# EAGLE schematic stm v0.7 (EAGLE 9.5.1)
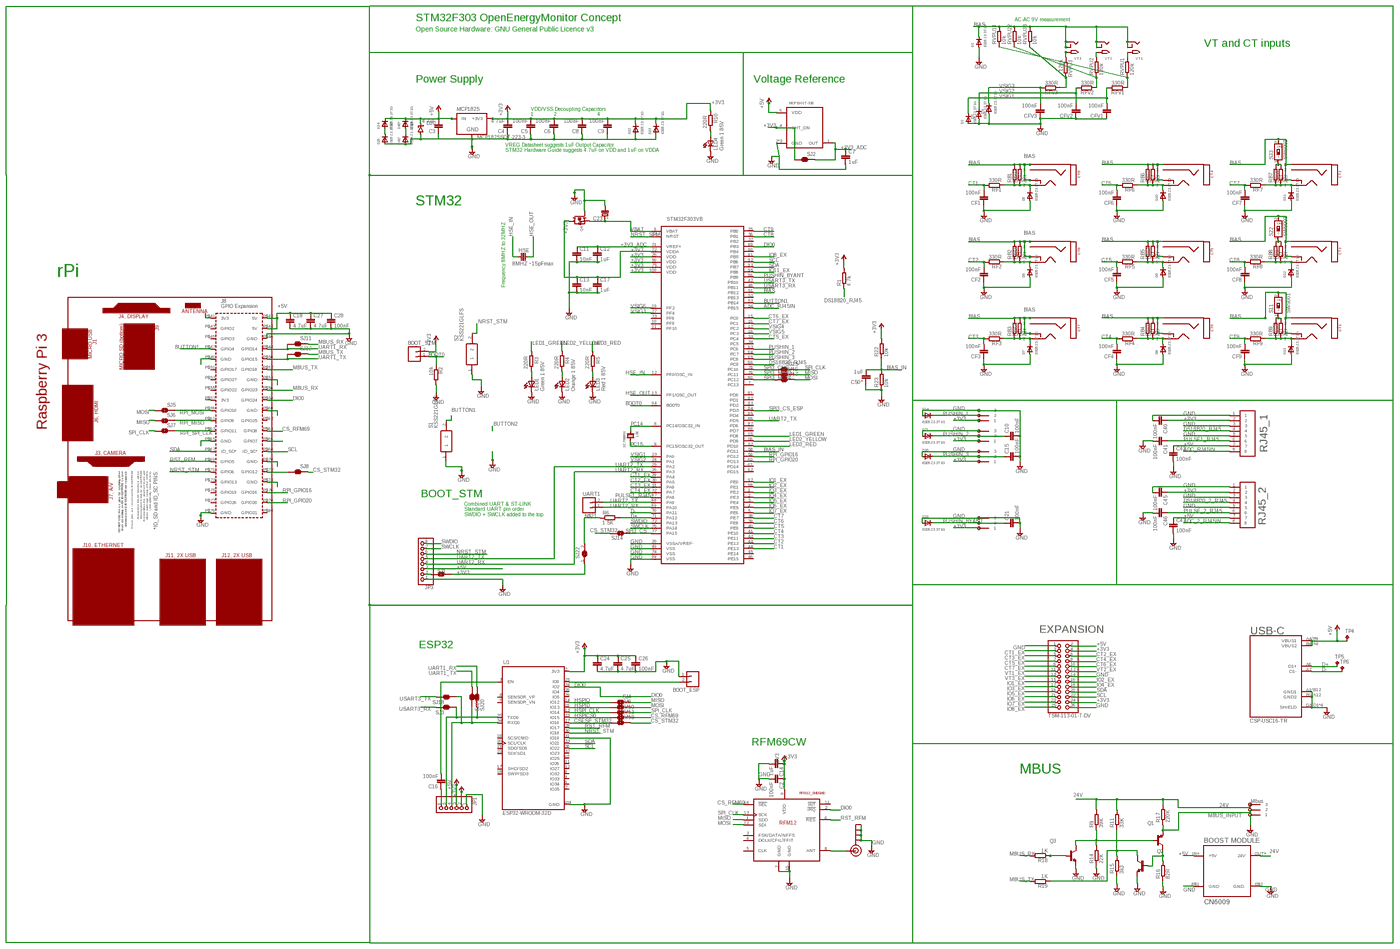
[diagram p0: schematic, sheet 1, overview]
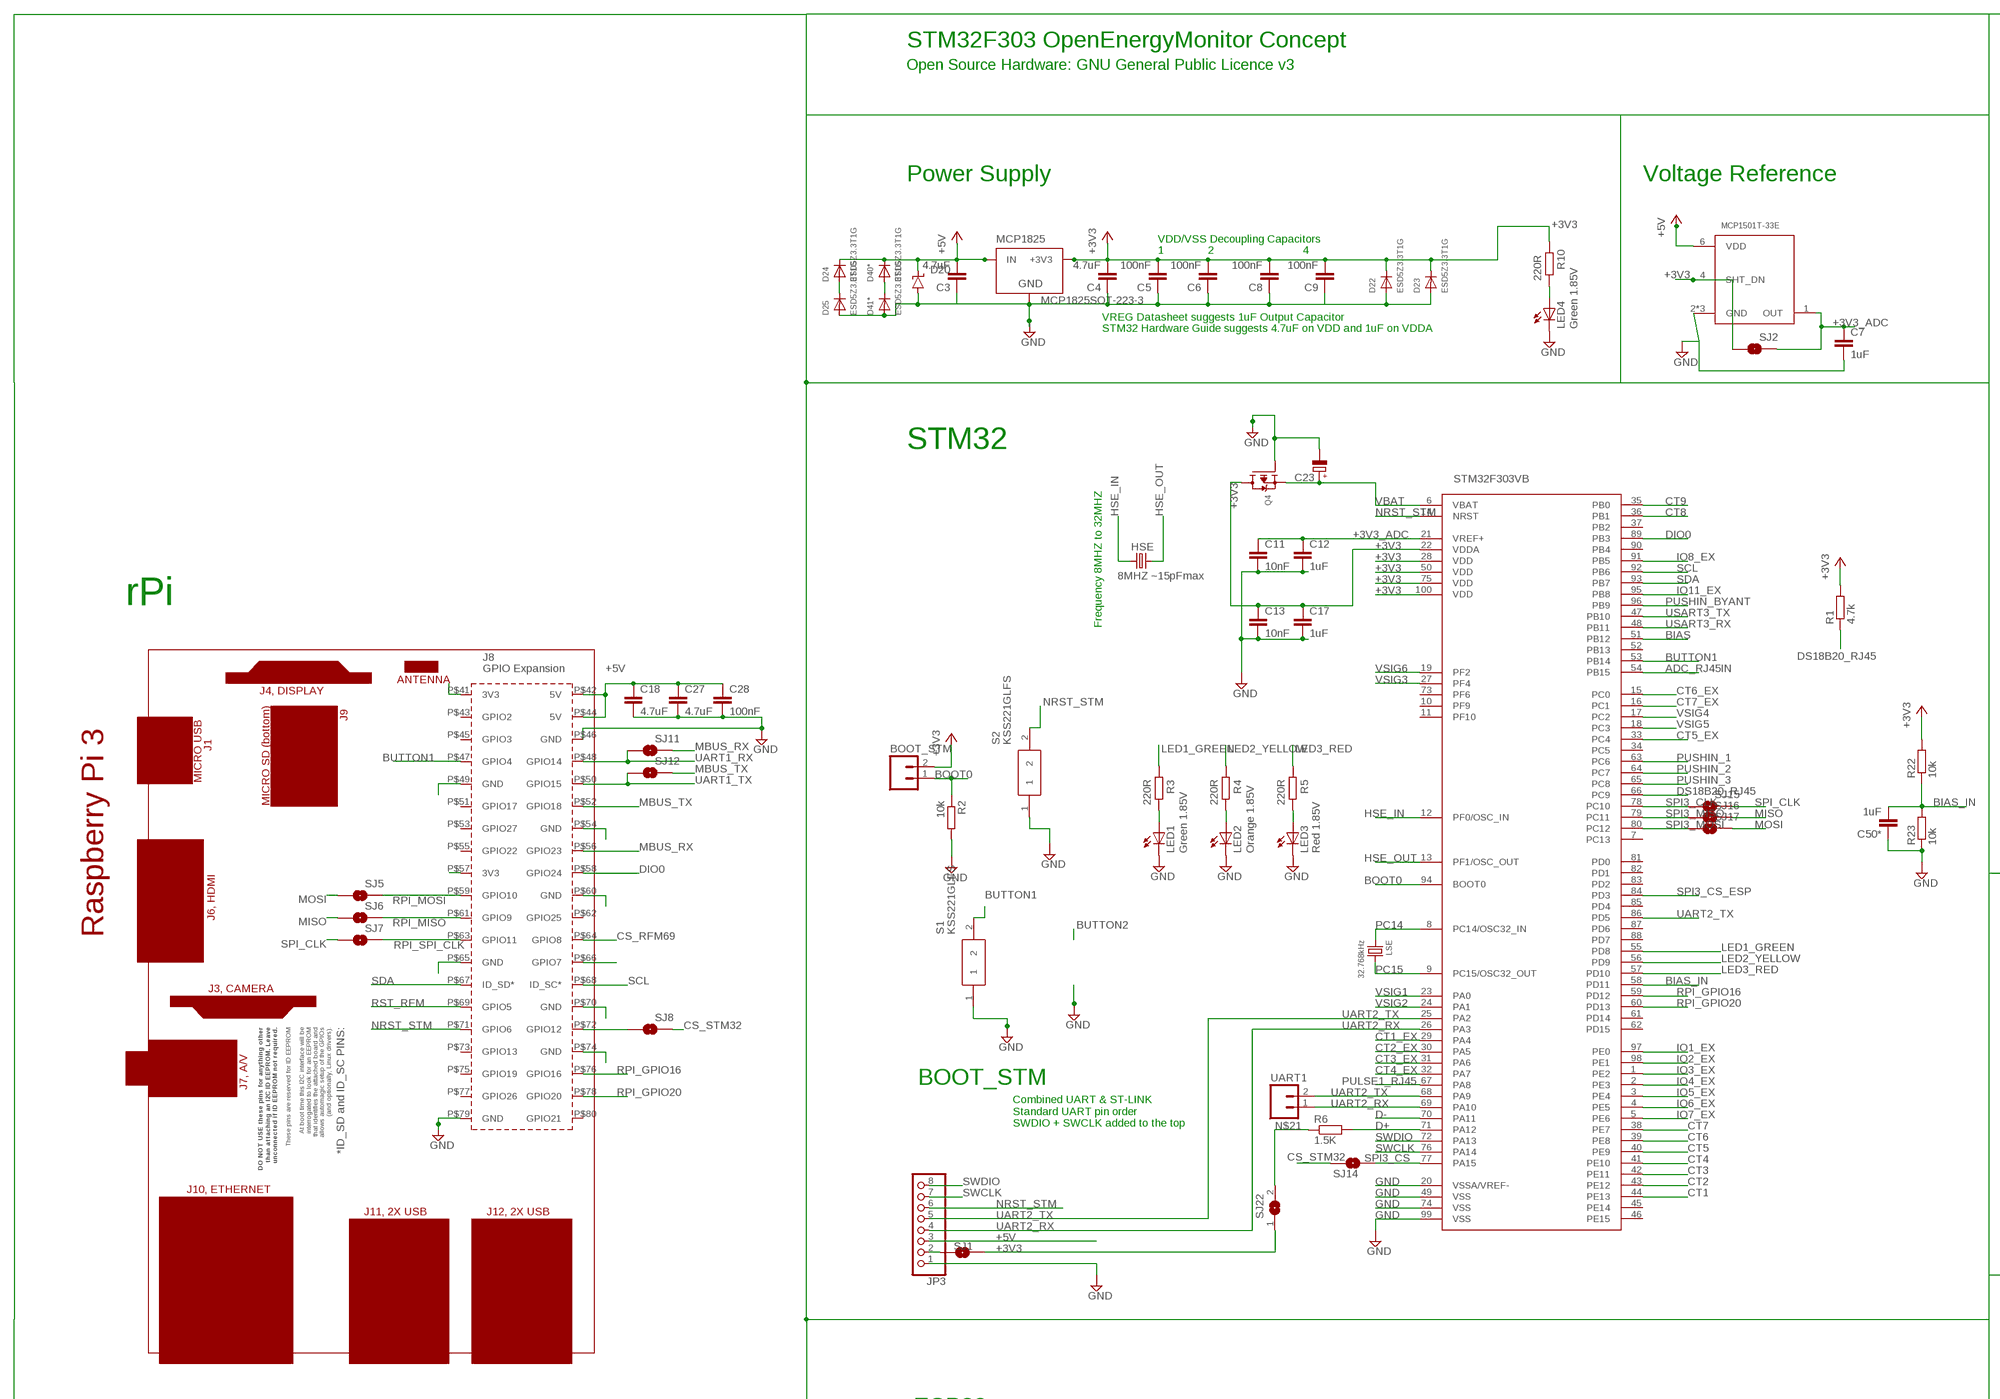
[diagram p1: schematic, sheet 1, part 1 of 4]
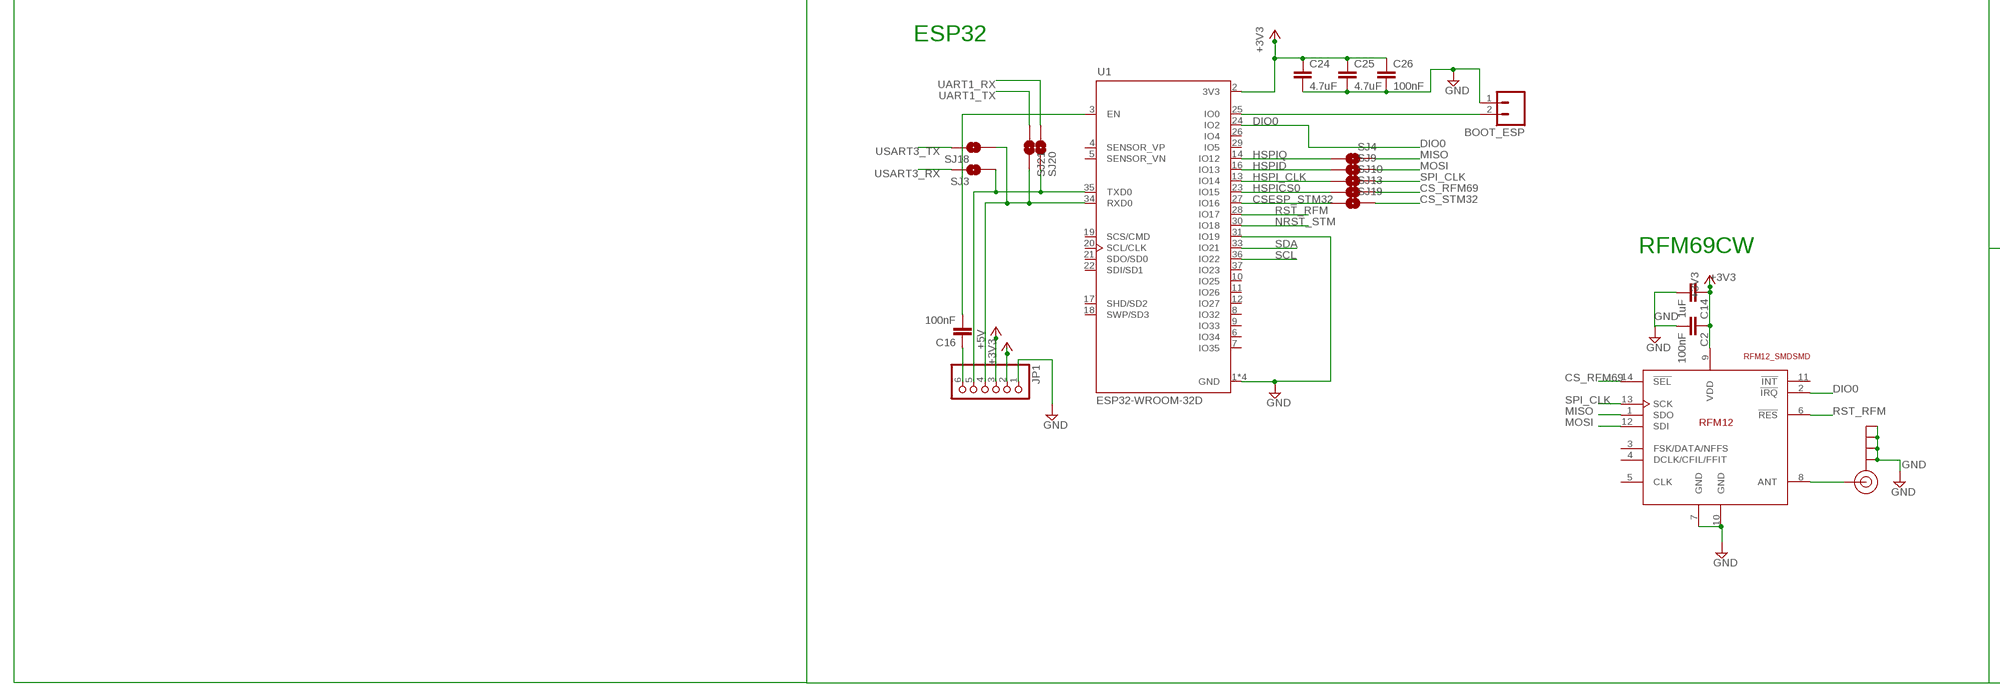
[diagram p2: schematic, sheet 1, part 2 of 4]
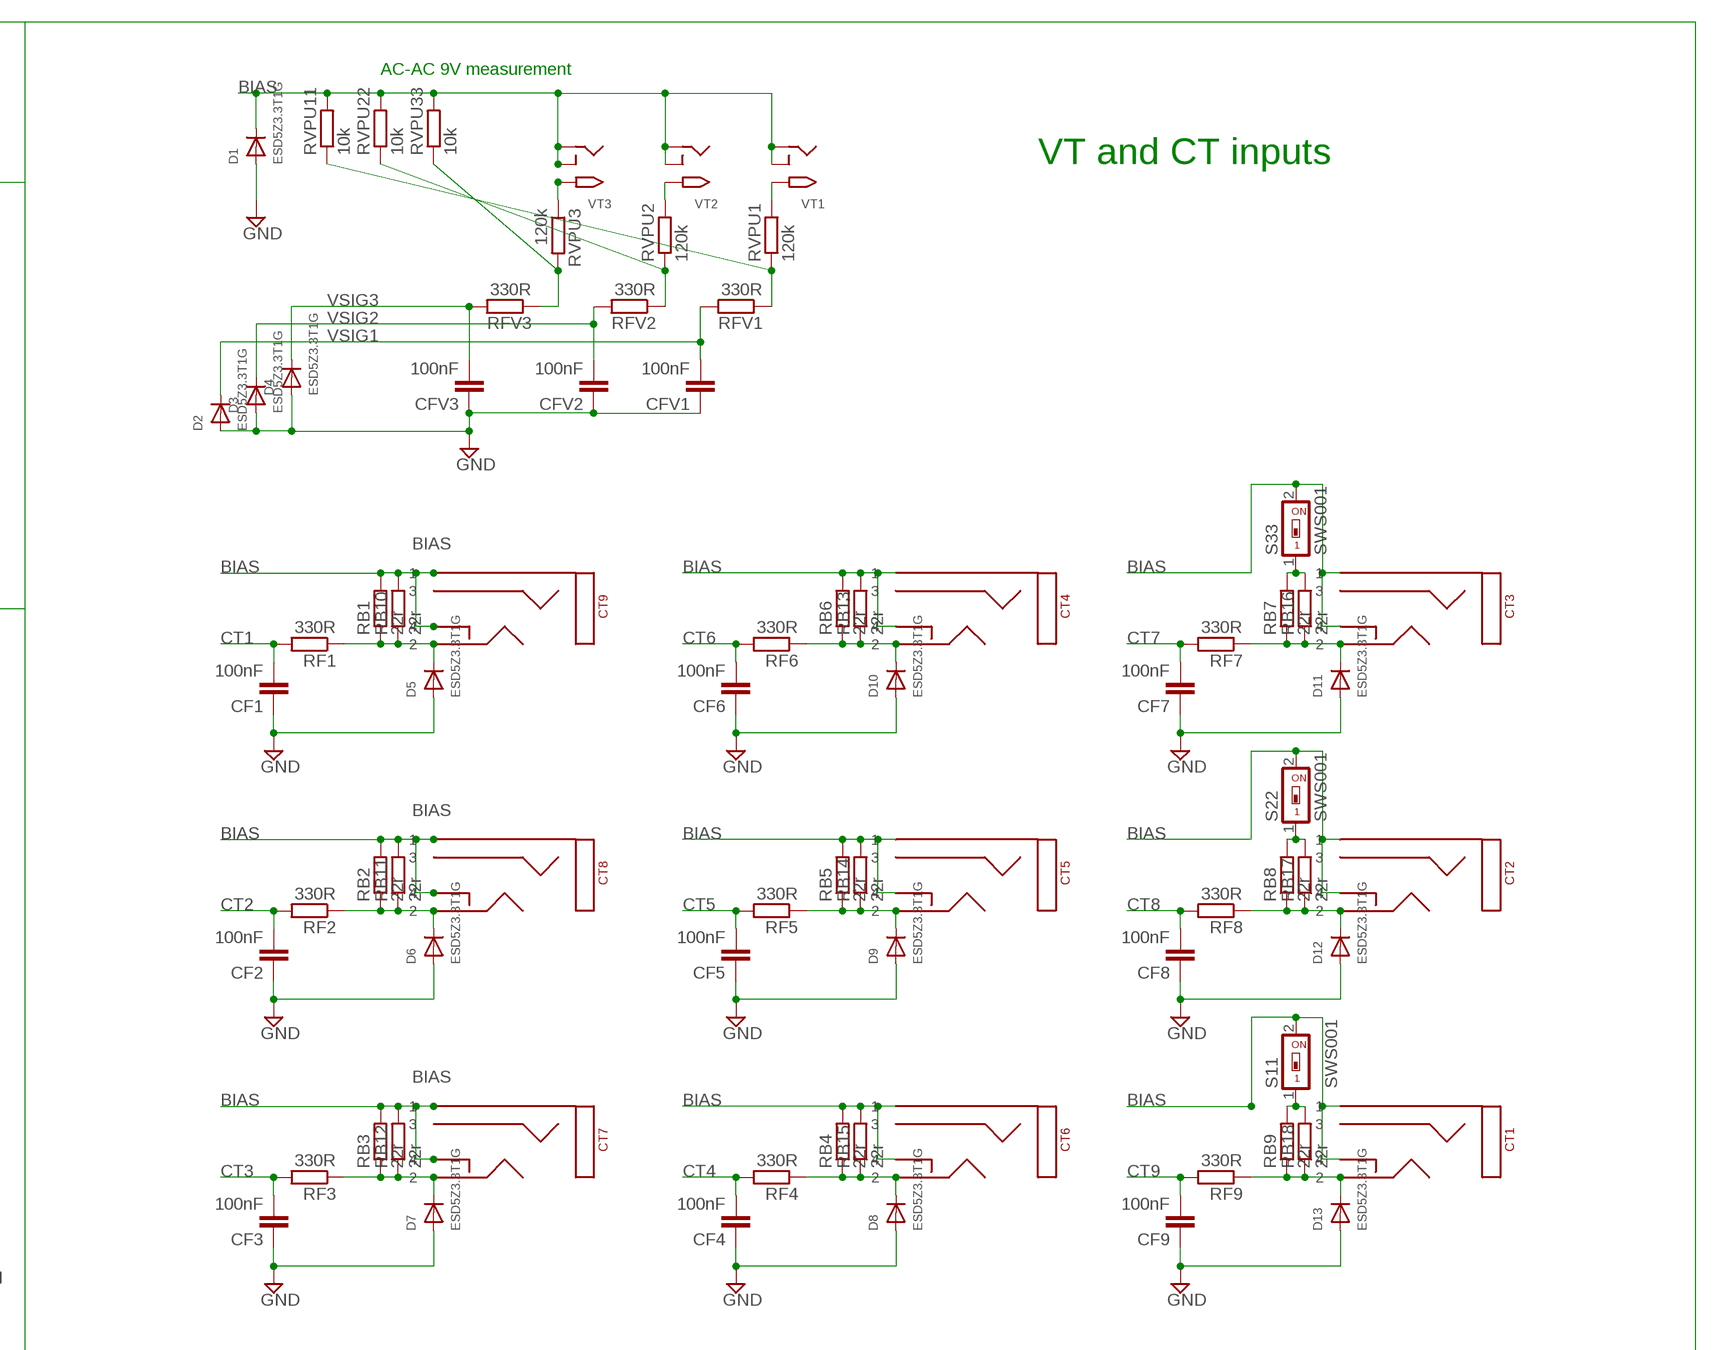
[diagram p3: schematic, sheet 1, part 3 of 4]
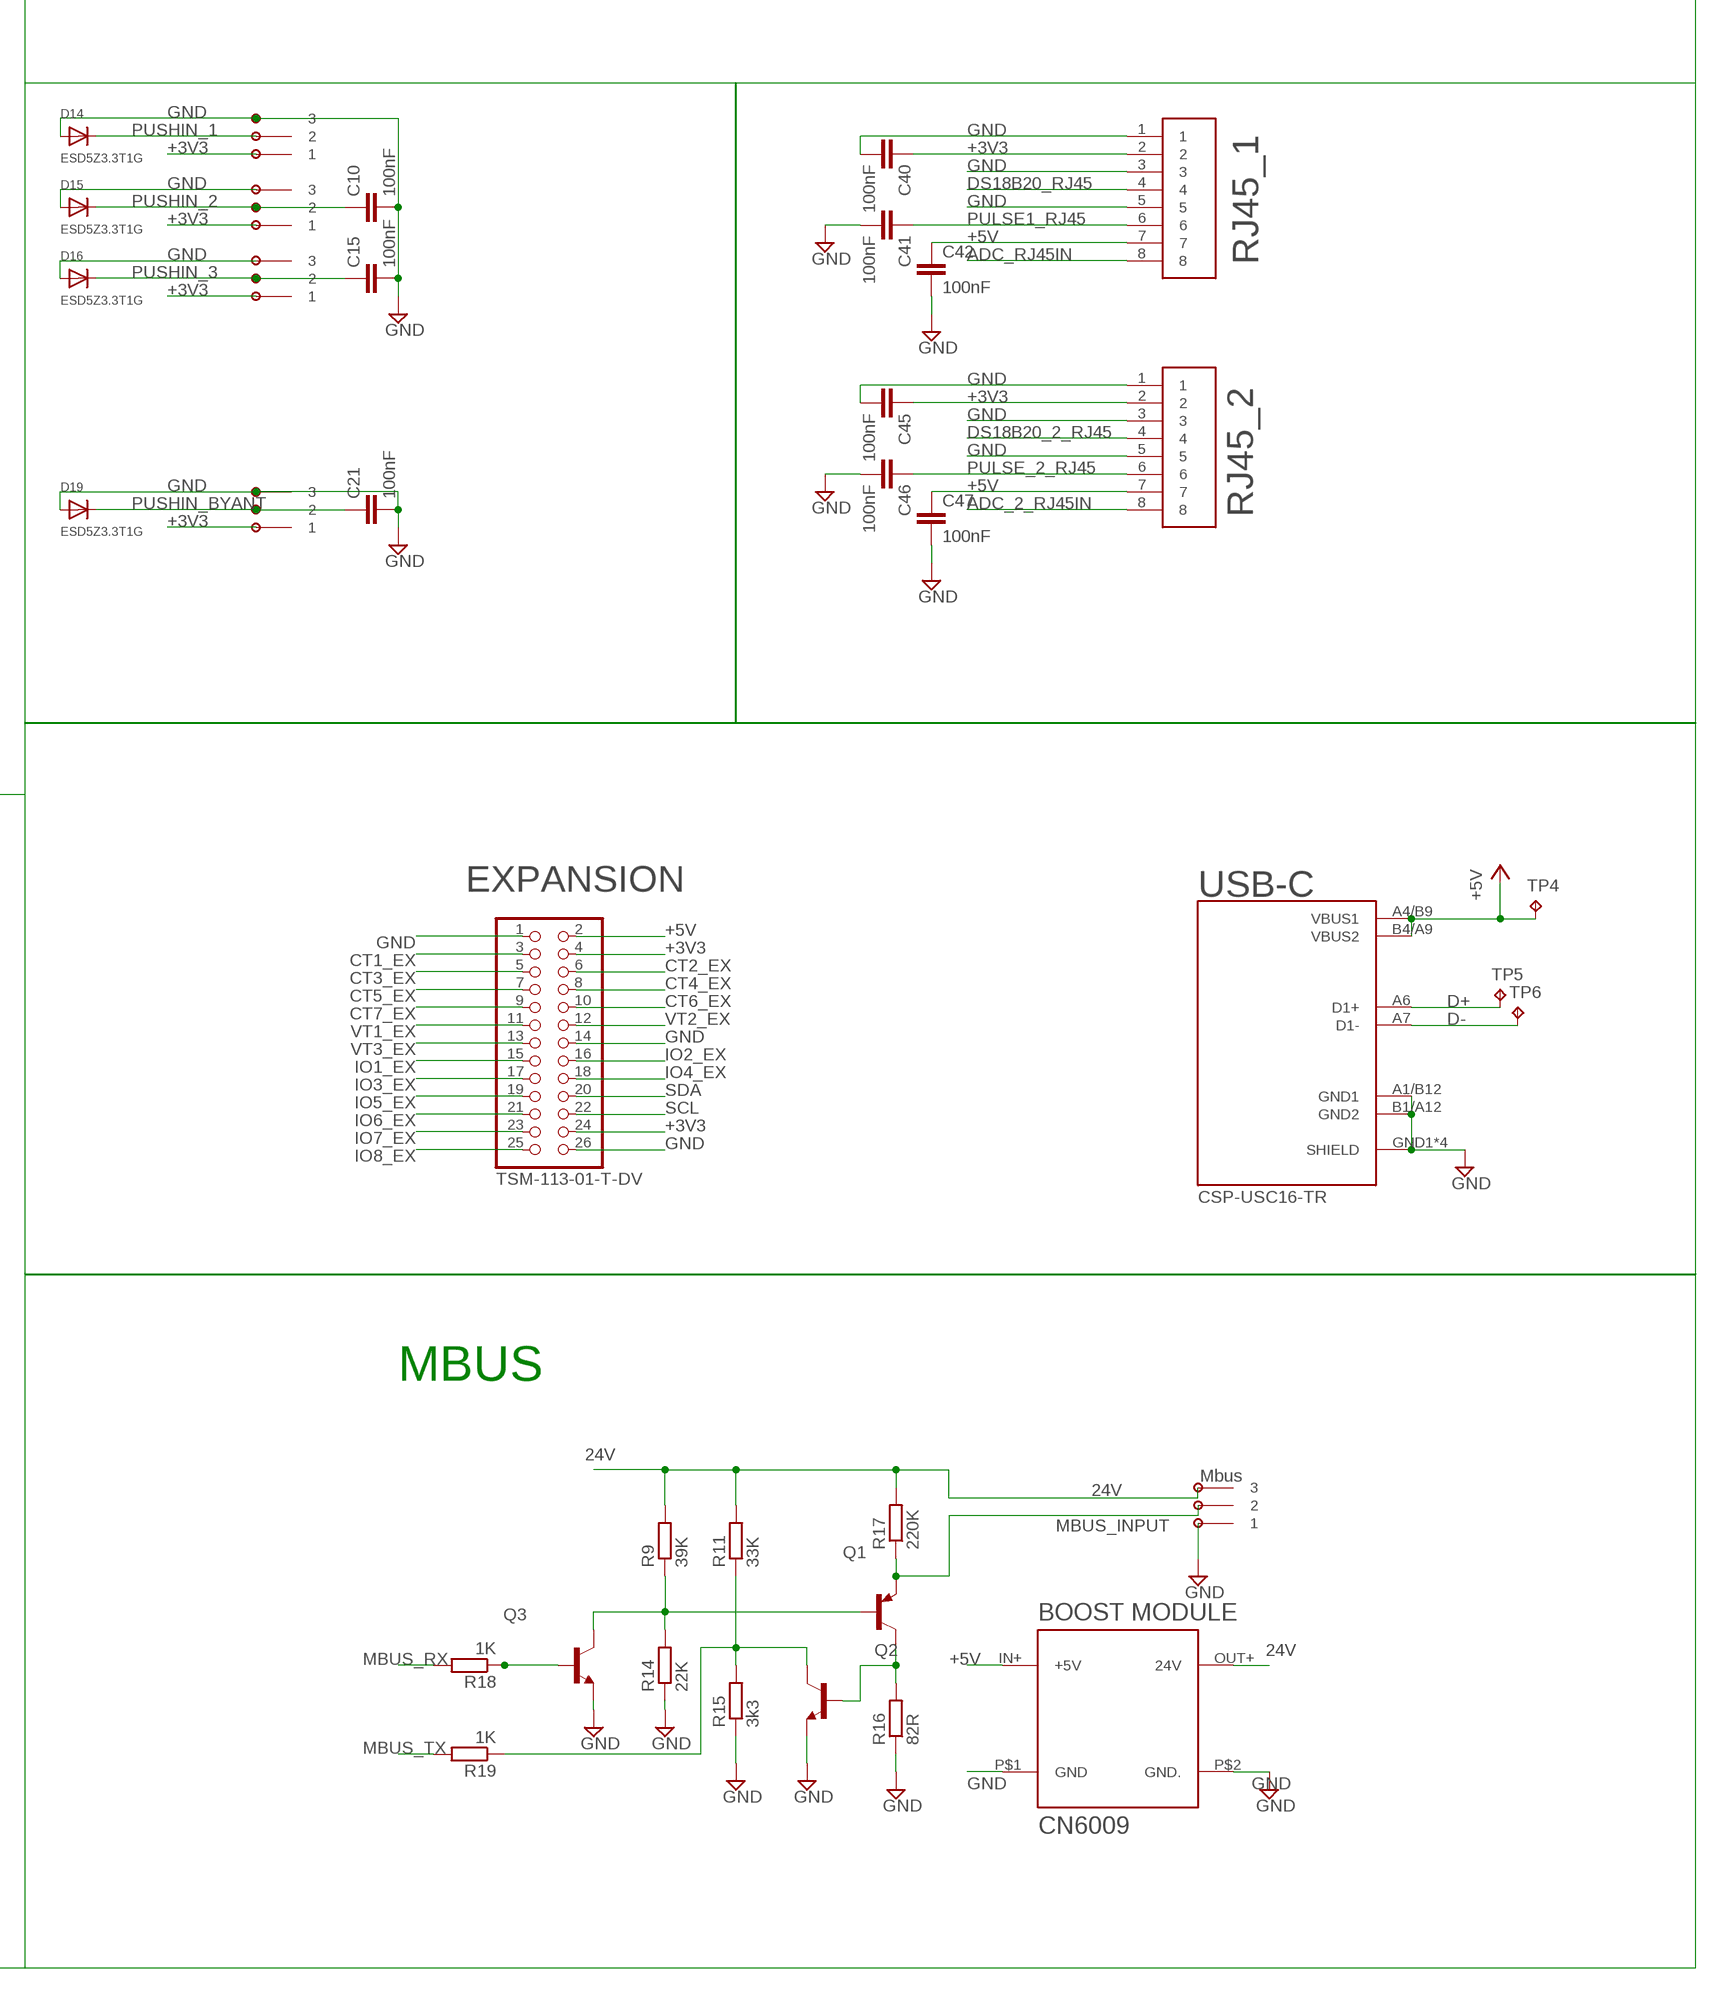
[diagram p4: schematic, sheet 1, part 4 of 4]

## Parts
3POLE_1  OMNIMATE_LSF_3COMBICON_SMT_3  [OMNIMATE_LSF_3_SMT]
3POLE_2  OMNIMATE_LSF_3COMBICON_SMT_3  [OMNIMATE_LSF_3_SMT]
3POLE_3  OMNIMATE_LSF_3COMBICON_SMT_3  [OMNIMATE_LSF_3_SMT]
3POLE_6  OMNIMATE_LSF_3COMBICON_SMT_3  [OMNIMATE_LSF_3_SMT]
3POLE_7  OMNIMATE_LSF_3COMBICON_SMT_3  [OMNIMATE_LSF_3_SMT]
BOOT_ESP  M02PTH  [1X02]
BOOT_STM  M02PTH  [1X02]
C2  100nF  C-EUC0603  [C0603]
C3  4.7uF  C-EUC0805  [C0805]
C4  4.7uF  C-EUC0805  [C0805]
C5  100nF  C-EUC0603  [C0603]
C6  100nF  C-EUC0603  [C0603]
C7  1uF  C-EUC0805  [C0805]
C8  100nF  C-EUC0603  [C0603]
C9  100nF  C-EUC0603  [C0603]
C10  100nF  C-EUC0603  [C0603]
C11  10nF  C-EUC0603  [C0603]
C12  1uF  C-EUC0805  [C0805]
C13  10nF  C-EUC0603  [C0603]
C14  1uF  C-EUC0805  [C0805]
C15  100nF  C-EUC0603  [C0603]
C16  100nF  C-EUC0603  [C0603]
C17  1uF  C-EUC0805  [C0805]
C18  4.7uF  C-EUC0805  [C0805]
C21  100nF  C-EUC0603  [C0603]
C23  CPOL-EU153CLV-1010  [153CLV-1010]
C24  4.7uF  C-EUC0805  [C0805]
C25  4.7uF  C-EUC0805  [C0805]
C26  100nF  C-EUC0603  [C0603]
C27  4.7uF  C-EUC0805  [C0805]
C28  100nF  C-EUC0603  [C0603]
C40  100nF  C-EUC0603  [C0603]
C41  100nF  C-EUC0603  [C0603]
C42  100nF  C-EUC0603  [C0603]
C45  100nF  C-EUC0603  [C0603]
C46  100nF  C-EUC0603  [C0603]
C47  100nF  C-EUC0603  [C0603]
C50*  1uF  C-EUC0603  [C0603]
CF1  100nF  C-EUC0603  [C0603]
CF2  100nF  C-EUC0603  [C0603]
CF3  100nF  C-EUC0603  [C0603]
CF4  100nF  C-EUC0603  [C0603]
CF5  100nF  C-EUC0603  [C0603]
CF6  100nF  C-EUC0603  [C0603]
CF7  100nF  C-EUC0603  [C0603]
CF8  100nF  C-EUC0603  [C0603]
CF9  100nF  C-EUC0603  [C0603]
CFV1  100nF  C-EUC0603  [C0603]
CFV2  100nF  C-EUC0603  [C0603]
CFV3  100nF  C-EUC0603  [C0603]
CT1  STEREO_SMD  [STEREO_SMT]
CT2  STEREO_SMD  [STEREO_SMT]
CT3  STEREO_SMD  [STEREO_SMT]
CT4  STEREO_SMD  [STEREO_SMT]
CT5  STEREO_SMD  [STEREO_SMT]
CT6  STEREO_SMD  [STEREO_SMT]
CT7  STEREO_SMD  [STEREO_SMT]
CT8  STEREO_SMD  [STEREO_SMT]
CT9  STEREO_SMD  [STEREO_SMT]
D1  ESD5Z3.3T1G  DIODESOD-523  [SOD-523]
D2  ESD5Z3.3T1G  DIODESOD-523  [SOD-523]
D3  ESD5Z3.3T1G  DIODESOD-523  [SOD-523]
D4  ESD5Z3.3T1G  DIODESOD-523  [SOD-523]
D5  ESD5Z3.3T1G  DIODESOD-523  [SOD-523]
D6  ESD5Z3.3T1G  DIODESOD-523  [SOD-523]
D7  ESD5Z3.3T1G  DIODESOD-523  [SOD-523]
D8  ESD5Z3.3T1G  DIODESOD-523  [SOD-523]
D9  ESD5Z3.3T1G  DIODESOD-523  [SOD-523]
D10  ESD5Z3.3T1G  DIODESOD-523  [SOD-523]
D11  ESD5Z3.3T1G  DIODESOD-523  [SOD-523]
D12  ESD5Z3.3T1G  DIODESOD-523  [SOD-523]
D13  ESD5Z3.3T1G  DIODESOD-523  [SOD-523]
D14  ESD5Z3.3T1G  DIODESOD-523  [SOD-523]
D15  ESD5Z3.3T1G  DIODESOD-523  [SOD-523]
D16  ESD5Z3.3T1G  DIODESOD-523  [SOD-523]
D19  ESD5Z3.3T1G  DIODESOD-523  [SOD-523]
D20  SUPPRESSOR-SMBJ  [SMBJ]
D22  ESD5Z3.3T1G  DIODESOD-523  [SOD-523]
D23  ESD5Z3.3T1G  DIODESOD-523  [SOD-523]
D24  ESD5Z3.3T1G  DIODESOD-523  [SOD-523]
D25  ESD5Z3.3T1G  DIODESOD-523  [SOD-523]
D40*  ESD5Z3.3T1G  DIODESOD-523  [SOD-523]
D41*  ESD5Z3.3T1G  DIODESOD-523  [SOD-523]
EXPANSION  TSM-113-01-T-DV  PINHD-2X13SMT  [2X13_SMT]
HSE  8MHZ ~15pFmax  CRYSTALCTS406  [CTS406]
J$1  SMA_EDGE  [SMA-EDGE]
JP1  PINHD-1X61X06_SMT  [1X06_SMT]
JP3  PINHD-1X81X08_SMT  [1X08_SMT]
LED1  Green 1.85V  LEDCHIP-LED0805  [CHIP-LED0805]
LED2  Orange 1.85V  LEDCHIP-LED0805  [CHIP-LED0805]
LED3  Red 1.85V  LEDCHIP-LED0805  [CHIP-LED0805]
LED4  Green 1.85V  LEDCHIP-LED0805  [CHIP-LED0805]
LSE  32.768kHz  CRYSTAL8X3.8SMT  [CRYSTAL_8X3.8]
MCP1825  MCP1825SOT-223-3  [SOT-223]
PCB2  RPI3YA  [RPI3MIRROR2]
Q1  MMBT3906  [SOT23]
Q2  MMBT3904  [SOT23]
Q3  MMBT3904  [SOT23]
Q4  MOSFET-P  [SOT23-R]
R1  4.7k  R-EU_R0603  [R0603]
R2  10k  R-EU_R0603  [R0603]
R3  220R  R-EU_R0603  [R0603]
R4  220R  R-EU_R0603  [R0603]
R5  220R  R-EU_R0603  [R0603]
R6  1.5K  R-EU_R0603  [R0603]
R9  39K  R-EU_R0603  [R0603]
R10  220R  R-EU_R0603  [R0603]
R11  33K  R-EU_R0603  [R0603]
R14  22K  R-EU_R0603  [R0603]
R15  3k3  R-EU_R0603  [R0603]
R16  82R  R-EU_R0603  [R0603]
R17  220K  R-EU_R0603  [R0603]
R18  1K  R-EU_R0603  [R0603]
R19  1K  R-EU_R0603  [R0603]
R22  10k  R-EU_R0603  [R0603]
R23  10k  R-EU_R0603  [R0603]
RB1  22r  R-EU_R0603  [R0603]
RB2  22r  R-EU_R0603  [R0603]
RB3  22r  R-EU_R0603  [R0603]
RB4  22r  R-EU_R0603  [R0603]
RB5  22r  R-EU_R0603  [R0603]
RB6  22r  R-EU_R0603  [R0603]
RB7  22r  R-EU_R0603  [R0603]
RB8  22r  R-EU_R0603  [R0603]
RB9  22r  R-EU_R0603  [R0603]
RB10  22r  R-EU_0207/7  [0207/7]
RB11  22r  R-EU_0207/7  [0207/7]
RB12  22r  R-EU_0207/7  [0207/7]
RB13  22r  R-EU_0207/7  [0207/7]
RB14  22r  R-EU_0207/7  [0207/7]
RB15  22r  R-EU_0207/7  [0207/7]
RB16  22r  R-EU_0207/7  [0207/7]
RB17  22r  R-EU_0207/7  [0207/7]
RB18  22r  R-EU_0207/7  [0207/7]
RF1  330R  R-EU_R0603  [R0603]
RF2  330R  R-EU_R0603  [R0603]
RF3  330R  R-EU_R0603  [R0603]
RF4  330R  R-EU_R0603  [R0603]
RF5  330R  R-EU_R0603  [R0603]
RF6  330R  R-EU_R0603  [R0603]
RF7  330R  R-EU_R0603  [R0603]
RF8  330R  R-EU_R0603  [R0603]
RF9  330R  R-EU_R0603  [R0603]
RFM69HCW  RFM12_SMDSMD  [RFM12]
RFV1  330R  R-EU_R0603  [R0603]
RFV2  330R  R-EU_R0603  [R0603]
RFV3  330R  R-EU_R0603  [R0603]
RJ45_1  95501-6889  [955016889]
RJ45_2  95501-6889  [955016889]
RVPU1  120k  R-EU_R0603  [R0603]
RVPU2  120k  R-EU_R0603  [R0603]
RVPU3  120k  R-EU_R0603  [R0603]
RVPU11  10k  R-EU_R0603  [R0603]
RVPU22  10k  R-EU_R0603  [R0603]
RVPU33  10k  R-EU_R0603  [R0603]
S1  KSS221GLFS  [KSS]
S2  KSS221GLFS  [KSS]
S11  SWS001  [SMS-001]
S22  SWS001  [SMS-001]
S33  SWS001  [SMS-001]
SJ1  SOLDERJUMPERNO  [SJ_2S-NO]
SJ2  SOLDERJUMPERNO  [SJ_2S-NO]
SJ3  SOLDERJUMPERNO  [SJ_2S-NO]
SJ4  SOLDERJUMPERNO  [SJ_2S-NO]
SJ5  SOLDERJUMPERNO  [SJ_2S-NO]
SJ6  SOLDERJUMPERNO  [SJ_2S-NO]
SJ7  SOLDERJUMPERNO  [SJ_2S-NO]
SJ8  SOLDERJUMPERNO  [SJ_2S-NO]
SJ9  SOLDERJUMPERNO  [SJ_2S-NO]
SJ10  SOLDERJUMPERNO  [SJ_2S-NO]
SJ11  SOLDERJUMPERNO  [SJ_2S-NO]
SJ12  SOLDERJUMPERNO  [SJ_2S-NO]
SJ13  SOLDERJUMPERNO  [SJ_2S-NO]
SJ14  SOLDERJUMPERNO  [SJ_2S-NO]
SJ15  SOLDERJUMPERNO  [SJ_2S-NO]
SJ16  SOLDERJUMPERNO  [SJ_2S-NO]
SJ17  SOLDERJUMPERNO  [SJ_2S-NO]
SJ18  SOLDERJUMPERNO  [SJ_2S-NO]
SJ19  SOLDERJUMPERNO  [SJ_2S-NO]
SJ20  SOLDERJUMPERNO  [SJ_2S-NO]
SJ21  SOLDERJUMPERNO  [SJ_2S-NO]
SJ22  SJ-CONCON  [SJ-CON]
STM32F303VB  STM32F303XB  [TQFP100]
TP4  TPB1,27  [B1,27]
TP5  TPB1,27  [B1,27]
TP6  TPB1,27  [B1,27]
U1  ESP32-WROOM-32D  [MODULE_ESP32-WROOM-32D]
U$2  BOOST_MODULE  [BOOST]
UART1  M02PTH  [1X02]
USB-C  CSP-USC16-TR  [USB-C]
VREF_3V3  MCP1501T-33E  [SOT95P280X145-6N]
VT1  2.1MMJACKSMT  [DCJACK_2MM_SMT]
VT2  2.1MMJACKSMT  [DCJACK_2MM_SMT]
VT3  2.1MMJACKSMT  [DCJACK_2MM_SMT]

## Nets
24V: 3POLE_7.P$3 R9.2 R11.2 R17.2 U$2.OUT+(24V)
+3V3 [power]: 3POLE_1.P$1 3POLE_2.P$1 3POLE_3.P$1 3POLE_6.P$1 BOOT_STM.2 C2.1 C4.2 C5.2 C6.2 C8.2 C9.2 C13.1 C14.1 C17.1 C24.1 C25.1 C26.1 C40.1 C45.1 D22.K(C) D23.K(C) EXPANSION.4 EXPANSION.24 JP1.2 MCP1825.3(+3V3) Q4.3(D) R1.2 R10.2 R22.2 RFM69HCW.9(VDD) RJ45_1.2 RJ45_2.2 SJ1.2 SJ2.1 SJ22.1 STM32F303VB.22(VDDA) STM32F303VB.28(VDD) STM32F303VB.50(VDD) STM32F303VB.75(VDD) STM32F303VB.100(VDD) U1.2(3V3) VREF_3V3.4(SHT_DN)
+3V3_ADC: C7.1 C11.1 C12.1 SJ2.2 STM32F303VB.21(VREF+) VREF_3V3.1(OUT)
+5V [power]: C3.2 C18.1 C27.1 C28.1 C42.1 C47.1 D20.C D24.K(C) D40*.K(C) EXPANSION.2 JP1.3 JP3.3 MCP1825.1(IN) PCB2.P$42(5V) PCB2.P$44(5V) RJ45_1.7 RJ45_2.7 TP4.TP U$2.IN+(+5V) USB-C.A4/B9(VBUS1) USB-C.B4/A9(VBUS2) VREF_3V3.6(VDD)
AC1: RVPU1.2 VT1.PWR2(TIP)
AC2: RVPU2.2 VT2.PWR2(TIP)
AC3: RVPU3.1 VT3.PWR2(TIP)
ADC0: RFV3.1 RVPU3.2 RVPU33.1
ADC_2_RJ45IN: RJ45_2.8
ADC_RJ45IN: RJ45_1.8 STM32F303VB.54(PB15)
BIAS: CT1.P$1 CT1.P$4 CT2.P$1 CT2.P$4 CT3.P$1 CT3.P$4 CT4.P$1 CT4.P$4 CT5.P$1 CT5.P$4 CT6.P$1 CT6.P$4 CT7.P$1 CT7.P$4 CT8.P$1 CT8.P$4 CT9.P$1 CT9.P$4 D1.K(C) RB1.2 RB2.2 RB3.2 RB4.2 RB5.2 RB6.2 RB10.2 RB11.2 RB12.2 RB13.2 RB14.2 RB15.2 RVPU11.2 RVPU22.2 RVPU33.2 S11.2 S22.2 S33.2 STM32F303VB.51(PB12) VT1.GND(RING) VT1.GNDBREAK(RING_SW) VT2.GND(RING) VT2.GNDBREAK(RING_SW) VT3.GND(RING) VT3.GNDBREAK(RING_SW)
BIAS_IN: C50*.2 R22.1 R23.2 STM32F303VB.58(PD11)
BOOT0: BOOT_STM.1 R2.1 STM32F303VB.94(BOOT0)
BUTTON1: PCB2.P$47(GPIO4) S1.2 STM32F303VB.53(PB14)
CS_RFM69: PCB2.P$64(GPIO8) RFM69HCW.14(!SEL) SJ13.2
CS_STM32: SJ8.2 SJ14.1 SJ19.2
CSESP_STM32: SJ19.1 U1.27(IO16)
CT1: CF1.2 RF1.2 STM32F303VB.44(PE13)
CT1_EX: EXPANSION.3 STM32F303VB.29(PA4)
CT2: CF2.2 RF2.2 STM32F303VB.43(PE12)
CT2_EX: EXPANSION.6 STM32F303VB.30(PA5)
CT3: CF3.2 RF3.2 STM32F303VB.42(PE11)
CT3_EX: EXPANSION.5 STM32F303VB.31(PA6)
CT4: CF4.2 RF4.2 STM32F303VB.41(PE10)
CT4_EX: EXPANSION.8 STM32F303VB.32(PA7)
CT5: CF5.2 RF5.2 STM32F303VB.40(PE9)
CT5_EX: EXPANSION.7 STM32F303VB.33(PC4)
CT6: CF6.2 RF6.2 STM32F303VB.39(PE8)
CT6_EX: EXPANSION.10 STM32F303VB.15(PC0)
CT7: CF7.2 RF7.2 STM32F303VB.38(PE7)
CT7_EX: EXPANSION.9 STM32F303VB.16(PC1)
CT8: CF8.2 RF8.2 STM32F303VB.36(PB1)
CT9: CF9.2 RF9.2 STM32F303VB.35(PB0)
D+: R6.2 STM32F303VB.71(PA12) TP5.TP USB-C.A6(D1+)
D-: STM32F303VB.70(PA11) TP6.TP USB-C.A7(D1-)
DIO0: PCB2.P$58(GPIO24) RFM69HCW.2(!IRQ) STM32F303VB.89(PB3) U1.24(IO2)
DS18B20_2_RJ45: RJ45_2.4
DS18B20_RJ45: R1.1 RJ45_1.4 STM32F303VB.66(PC9)
GND [power]: 3POLE_1.P$3 3POLE_2.P$3 3POLE_3.P$3 3POLE_6.P$3 3POLE_7.P$1 BOOT_ESP.1 C2.2 C3.1 C4.1 C5.1 C6.1 C7.2 C8.1 C9.1 C10.2 C11.2 C12.2 C13.2 C14.2 C15.2 C17.2 C18.2 C21.2 C23.- C24.2 C25.2 C26.2 C27.2 C28.2 C40.2 C41.2 C42.2 C45.2 C46.2 C47.2 C50*.1 CF1.1 CF2.1 CF3.1 CF4.1 CF5.1 CF6.1 CF7.1 CF8.1 CF9.1 CFV1.1 CFV2.1 CFV3.1 D1.A D2.A D3.A D4.A D5.A D6.A D7.A D8.A D9.A D10.A D11.A D12.A D13.A D14.A D15.A D16.A D19.A D20.A D22.A D23.A D25.A D41*.A EXPANSION.1 EXPANSION.14 EXPANSION.26 J$1.GND@0(GND) J$1.GND@1(GND) J$1.GND@2(GND) J$1.GND@3(GND) JP1.1 JP3.1 LED1.C LED2.C LED3.C LED4.C MCP1825.2(GND) MCP1825.4(GND) PCB2.P$46(GND) PCB2.P$49(GND) PCB2.P$54(GND) PCB2.P$60(GND) PCB2.P$65(GND) PCB2.P$70(GND) PCB2.P$74(GND) PCB2.P$79(GND) Q2.2(E) Q3.2(E) Q4.1(G) R2.2 R14.1 R15.1 R16.1 R23.1 RFM69HCW.7(GND) RFM69HCW.10(GND) RJ45_1.1 RJ45_1.3 RJ45_1.5 RJ45_2.1 RJ45_2.3 RJ45_2.5 S1.1 S2.1 STM32F303VB.20(VSSA/VREF-) STM32F303VB.49(VSS) STM32F303VB.74(VSS) STM32F303VB.99(VSS) U1.1(GND) U1.15(GND) U1.31(IO19) U1.38(GND) U1.39(GND) U$2.P$1(GND) U$2.P$2(GND.) USB-C.A1/B12(GND1) USB-C.B1/A12(GND2) USB-C.GND1(SHIELD) USB-C.GND2(SHIELD) USB-C.GND3(SHIELD) USB-C.GND4(SHIELD) VREF_3V3.2(GND) VREF_3V3.3(GND) VREF_3V3.5(GND)
HSE_IN: HSE.1 STM32F303VB.12(PF0/OSC_IN)
HSE_OUT: HSE.3 STM32F303VB.13(PF1/OSC_OUT)
HSPI_CLK: SJ10.1 U1.13(IO14)
HSPICS0: SJ13.1 U1.23(IO15)
HSPID: SJ9.1 U1.16(IO13)
HSPIQ: SJ4.1 U1.14(IO12)
IO1_EX: EXPANSION.15 STM32F303VB.97(PE0)
IO2_EX: EXPANSION.16 STM32F303VB.98(PE1)
IO3_EX: EXPANSION.17 STM32F303VB.1(PE2)
IO4_EX: EXPANSION.18 STM32F303VB.2(PE3)
IO5_EX: EXPANSION.19 STM32F303VB.3(PE4)
IO6_EX: EXPANSION.21 STM32F303VB.4(PE5)
IO7_EX: EXPANSION.23 STM32F303VB.5(PE6)
IO8_EX: EXPANSION.25 STM32F303VB.91(PB5)
IO11_EX: STM32F303VB.95(PB8)
LED1_GREEN: R3.2 STM32F303VB.55(PD8)
LED2_YELLOW: R4.2 STM32F303VB.56(PD9)
LED3_RED: R5.2 STM32F303VB.57(PD10)
MBUS_INPUT: 3POLE_7.P$2 Q1.2(E) R17.1
MBUS_RX: PCB2.P$56(GPIO23) R18.2 SJ11.2
MBUS_TX: PCB2.P$52(GPIO18) R19.2 SJ12.2
MISO: RFM69HCW.1(SDO) SJ4.2 SJ6.1 SJ16.2
MOSI: RFM69HCW.12(SDI) SJ5.1 SJ9.2 SJ17.2
N$1: JP3.2 SJ1.1
N$2: CT9.P$2 D5.K(C) RB1.1 RB10.1 RF1.1
N$5: LED2.A R4.1
N$6: LED3.A R5.1
N$7: JP1.5 SJ3.1 SJ20.2 U1.35(TXD0)
N$8: CT8.P$2 D6.K(C) RB2.1 RB11.1 RF2.1
N$9: LED4.A R10.1
N$10: CT7.P$2 D7.K(C) RB3.1 RB12.1 RF3.1
N$11: JP1.4 SJ18.1 SJ21.2 U1.34(RXD0)
N$12: STM32F303VB.68(PA9) UART1.2
N$13: PCB2.P$66(GPIO7)
N$14: C16.1 JP1.6
N$15: C16.2 U1.3(EN)
N$16: PCB2.P$72(GPIO12) SJ8.1
N$17: BOOT_ESP.2 U1.25(IO0)
N$18: D24.A D25.K(C)
N$19: D40*.A D41*.K(C)
N$20: J$1.SIG(SIGNAL) RFM69HCW.8(ANT)
N$21 [power]: R6.1 SJ22.2
N$22: PCB2.P$41(3V3)
N$23: STM32F303VB.69(PA10) UART1.1
N$24: PCB2.P$57(3V3)
N$26: RB9.2 RB18.2 S11.1
N$27: RB8.2 RB17.2 S22.1
N$28: RB7.2 RB16.2 S33.1
N$30: Q1.3(C) Q2.1(B) R16.2
N$31: Q1.1(B) Q3.3(C) R9.1 R14.2
N$32: Q2.3(C) R11.1 R15.2 R19.1
N$33: Q3.1(B) R18.1
N$34: RFV2.1 RVPU2.1 RVPU22.1
N$37: RFV1.1 RVPU1.1 RVPU11.1
N$38: CT6.P$2 D8.K(C) RB4.1 RB15.1 RF4.1
N$39: CT5.P$2 D9.K(C) RB5.1 RB14.1 RF5.1
N$40: CT4.P$2 D10.K(C) RB6.1 RB13.1 RF6.1
N$41: LED1.A R3.1
N$42: CT3.P$2 D11.K(C) RB7.1 RB16.1 RF7.1
N$43: CT2.P$2 D12.K(C) RB8.1 RB17.1 RF8.1
N$44: CT1.P$2 D13.K(C) RB9.1 RB18.1 RF9.1
NRST_STM: JP3.6 PCB2.P$71(GPIO6) S2.2 STM32F303VB.14(NRST) U1.30(IO18)
PC14: LSE.P$1 STM32F303VB.8(PC14/OSC32_IN)
PC15: LSE.P$4 STM32F303VB.9(PC15/OSC32_OUT)
PULSE1_RJ45: C41.1 RJ45_1.6 STM32F303VB.67(PA8)
PULSE_2_RJ45: C46.1 RJ45_2.6
PUSHIN_1: 3POLE_1.P$2 D14.K(C) STM32F303VB.63(PC6)
PUSHIN_2: 3POLE_2.P$2 C10.1 D15.K(C) STM32F303VB.64(PC7)
PUSHIN_3: 3POLE_3.P$2 C15.1 D16.K(C) STM32F303VB.65(PC8)
PUSHIN_BYANT: 3POLE_6.P$2 C21.1 D19.K(C) STM32F303VB.96(PB9)
RPI_GPIO16: PCB2.P$76(GPIO16) STM32F303VB.59(PD12)
RPI_GPIO20: PCB2.P$78(GPIO20) STM32F303VB.60(PD13)
RPI_MISO: PCB2.P$61(GPIO9) SJ6.2
RPI_MOSI: PCB2.P$59(GPIO10) SJ5.2
RPI_SPI_CLK: PCB2.P$63(GPIO11) SJ7.2
RST_RFM: PCB2.P$69(GPIO5) RFM69HCW.6(!RES) U1.28(IO17)
SCL: EXPANSION.22 PCB2.P$68(ID_SC*) STM32F303VB.92(PB6) U1.36(IO22)
SDA: EXPANSION.20 PCB2.P$67(ID_SD*) STM32F303VB.93(PB7) U1.33(IO21)
SPI3_CLK: SJ15.1 STM32F303VB.78(PC10)
SPI3_CS: SJ14.2 STM32F303VB.77(PA15)
SPI3_CS_ESP: STM32F303VB.84(PD3)
SPI3_MISO: SJ16.1 STM32F303VB.79(PC11)
SPI3_MOSI: SJ17.1 STM32F303VB.80(PC12)
SPI_CLK: RFM69HCW.13(SCK) SJ7.1 SJ10.2 SJ15.2
SWCLK: JP3.7 STM32F303VB.76(PA14)
SWDIO: JP3.8 STM32F303VB.72(PA13)
UART1_RX: PCB2.P$48(GPIO14) SJ11.1 SJ20.1
UART1_TX: PCB2.P$50(GPIO15) SJ12.1 SJ21.1
UART2_RX: JP3.4 STM32F303VB.26(PA3)
UART2_TX: JP3.5 STM32F303VB.25(PA2) STM32F303VB.86(PD5)
USART3_RX: SJ3.2 STM32F303VB.48(PB11)
USART3_TX: SJ18.2 STM32F303VB.47(PB10)
VBAT: C23.+ Q4.2(S) STM32F303VB.6(VBAT)
VSIG1: CFV1.2 D2.K(C) RFV1.2 STM32F303VB.23(PA0)
VSIG2: CFV2.2 D3.K(C) RFV2.2 STM32F303VB.24(PA1)
VSIG3: CFV3.2 D4.K(C) RFV3.2 STM32F303VB.27(PF4)
VSIG4: STM32F303VB.17(PC2)
VSIG5: STM32F303VB.18(PC3)
VSIG6: STM32F303VB.19(PF2)
VT1_EX: EXPANSION.11
VT2_EX: EXPANSION.12
VT3_EX: EXPANSION.13
Unconnected: CT1.P$3 CT2.P$3 CT3.P$3 CT4.P$3 CT5.P$3 CT6.P$3 CT7.P$3 CT8.P$3 CT9.P$3 PCB2.P$43(GPIO2) PCB2.P$45(GPIO3) PCB2.P$51(GPIO17) PCB2.P$53(GPIO27) PCB2.P$55(GPIO22) PCB2.P$62(GPIO25) PCB2.P$73(GPIO13) PCB2.P$75(GPIO19) PCB2.P$77(GPIO26) PCB2.P$80(GPIO21) RFM69HCW.3(FSK/DATA/NFFS) RFM69HCW.4(DCLK/CFIL/FFIT) RFM69HCW.5(CLK) RFM69HCW.11(!INT) STM32F303VB.7(PC13) STM32F303VB.10(PF9) STM32F303VB.11(PF10) STM32F303VB.34(PC5) STM32F303VB.37(PB2) STM32F303VB.45(PE14) STM32F303VB.46(PE15) STM32F303VB.52(PB13) STM32F303VB.61(PD14) STM32F303VB.62(PD15) STM32F303VB.73(PF6) STM32F303VB.81(PD0) STM32F303VB.82(PD1) STM32F303VB.83(PD2) STM32F303VB.85(PD4) STM32F303VB.87(PD6) STM32F303VB.88(PD7) STM32F303VB.90(PB4) U1.4(SENSOR_VP) U1.5(SENSOR_VN) U1.6(IO34) U1.7(IO35) U1.8(IO32) U1.9(IO33) U1.10(IO25) U1.11(IO26) U1.12(IO27) U1.17(SHD/SD2) U1.18(SWP/SD3) U1.19(SCS/CMD) U1.20(SCL/CLK) U1.21(SDO/SD0) U1.22(SDI/SD1) U1.26(IO4) U1.29(IO5) U1.37(IO23)

## Notes on the sheet
- STM32F303 OpenEnergyMonitor Concept | AC-AC 9V measurement
- Open Source Hardware: GNU General Public Licence v3
- VT and CT inputs
- Power Supply | Voltage Reference
- VDD/VSS Decoupling Capacitors
- 1 | 2 | 4
- VREG Datasheet suggests 1uF Output Capacitor
- STM32 Hardware Guide suggests 4.7uF on VDD and 1uF on VDDA
- STM32
- rPi
- Frequency 8MHZ to 32MHZ
- BOOT_STM
- Combined UART & ST-LINK
  Standard UART pin order
  SWDIO + SWCLK added to the top
- ESP32
- RFM69CW
- MBUS
- Mbus

## Library data of the parts
3POLE_1-3POLE_3 3POLE_6 3POLE_7 = OMNIMATE_LSF:OMNIMATE_LSF_3
BOOT_ESP BOOT_STM UART1 = SparkFun:M02: Header 2 Standard 2-pin 0.1" header. Use with straight break away headers (SKU : PRT-00116), right angle break away headers (PRT-00553), swiss pins (PRT-00743), machine pins (PRT-00117), and female headers (PRT-00115). Molex polarized connector foot print use with SKU : PRT-08233 with associated crimp pins and housings.
C2 C5 C6 C8-C10 C15 C16 C21 C26 C28 C40-C42 C45-C47 CF1-CF9 CFV1-CFV3 = resistor:C-EU: CAPACITOR, European symbol
C3 C4 C7 C11-C14 C17 C18 C24 C25 C27 C50* = rcl:C-EU: CAPACITOR, European symbol; SPICEPREFIX: C
C23 = rcl:CPOL-EU: POLARIZED CAPACITOR, European symbol; SPICEPREFIX: C
CT1-CT9 = IotaWatt_parts:STEREO_SMD: 3.5mm Stereo Jack SMT
D1-D16 D19 D22-D25 D40* D41* = microbuilder:DIODE: Diode SMA Model Volts Amps Type Vf Vr Digikey # Notes SSA34-E3 40V 3A Schottky 480mV @ 3A 200uA @ 40V SSA34-E3/61TGITR-ND CDBA120-G 20V 1A Schottky 500mV @ 1A 500uA @ 20V 641-1014-6-ND REEL MBRA210 10V 2A Schottky 350mV @ 2A 700uA @ 10V MBRA210LT3 SOD-123 Model Volts Amps Type Vf Vr Order # Notes BAT54T1G 30V 200mA Schottky 800mV @ 200mA 2uA @ 25V BAT54T1GOSTR-ND B0530W 30V 500mA Schottky 430mV @ 500mA 130uA @ 30V B0530W-FDICT-ND REEL MBR120 1A 20V Schottky 340mV @ 1A MBR120VLSFT1GOSCT-ND SOD-323 Model Volts Amps Type Vf Vr Order # Notes PMEG2005EJ 20V 500mA Schottky 355mV @ 500mA 568-4110-1-ND ZLLS410 10V 570mA Schottky 380mV @ 570mA ZLLS410CT-ND 1N4148WS 75V 150mA Silicon/Simple 1V 1N4148WSFSCT-ND REEL SOD-523 Model Volts Amps Type Vf Vr Order # Notes BAT54XV2 30V 200mA Schottky 0.8V @ 100mA BAT54XV2CT-ND TB751S 30V 30mA Schottky RB751S-40TE61CT-ND SOT23-R/W (R = Solder Paste/Reflow Ovens, W = Hand-Soldering) Model Volts Amps Type Vf Vr Order # Notes BAT54FILM 40V 300mA Schottky 497-7162-1-ND
D20 = diode:SUPPRESSOR-: Suppressor diode
EXPANSION = pinhead+:PINHD-2X13: PIN HEADER
HSE = crystal:CRYSTAL: CRYSTAL; OC_FARNELL: unknown; OC_NEWARK: unknown
J$1 = SparkFun-Connectors:SMA_EDGE: SMA Antenna Connector End launch SMA connector. The paste layer has been removed so that the connector can be hand soldered onto the board after reflow.
JP1 = pinhead+:PINHD-1X6: PIN HEADER
JP3 = pinhead+:PINHD-1X8: PIN HEADER
LED1-LED4 = adafruit:LED: LED OSRAM: - CHIPLED LG R971, LG N971, LY N971, LG Q971, LY Q971, LO R971, LY R971 LH N974, LH R974 LS Q976, LO Q976, LY Q976 LO Q996 - Hyper CHIPLED LW Q18S LB Q993, LB Q99A, LB R99A - SideLED LS A670, LO A670, LY A670, LG A670, LP A670 LB A673, LV A673, LT A673, LW A673 LH A674 LY A675 LS A676, LA A676, LO A676, LY A676, LW A676 LS A679, LY A679, LG A679 - Hyper Micro SIDELED® LS Y876, LA Y876, LO Y876, LY Y876 LT Y87S - SmartLED LW L88C, LW L88S LB L89C, LB L89S, LG L890 LS L89K, LO L89K, LY L89K LS L896, LA L896, LO L896, LY L896 - TOPLED LS T670, LO T670, LY T670, LG T670, LP T670 LSG T670, LSP T670, LSY T670, LOP T670, LYG T670 LG T671, LOG T671, LSG T671 LB T673, LV T673, LT T673, LW T673 LH T674 LS T676, LA T676, LO T676, LY T676, LB T676, LH T676, LSB T676, LW T676 LB T67C, LV T67C, LT T67C, LS T67K, LO T67K, LY T67K, LW E67C LS E67B, LA E67B, LO E67B, LY E67B, LB E67C, LV E67C, LT E67C LW T67C LS T679, LY T679, LG T679 LS T770, LO T770, LY T770, LG T770, LP T770 LB T773, LV T773, LT T773, LW T773 LH T774 LS E675, LA E675, LY E675, LS T675 LS T776, LA T776, LO T776, LY T776, LB T776 LHGB T686 LT T68C, LB T68C - Hyper Mini TOPLED® LB M676 - Mini TOPLED Santana® LG M470 LS M47K, LO M47K, LY M47K Source: http://www.osram.convergy.de/
LSE = microbuilder:CRYSTAL: Crystals HC49UP - Surface Mount Crystal 4.0MHz 18pF +/-30ppm Surface Mount Crystal [Digikey: 535-9857-1-ND] 12.0 MHz Surface Mount Crystal [Digikey: 535-9869-6-ND] 25.0 MHz Surface Mount Crystal [Digikey: 535-9078-1-ND] 2.5 x 2.0mm - MEMs SMT Crystal 16.0 MHz 10pF 20ppm 2.5 x 2.0mm Crystal [Digikey -40-85°C: 535-10923-1-ND] 3.2 x 2.5mm - MEMs SMT Crystal 12.0 MHz 8pF 15ppm 3.2 x 2.5mm Crystal [Digikey: -10-70°C: 644-1047-1-ND -40-125°C: 644-1128-1-ND] 16.0 MHz 8pF 15ppm 3.2 x 2.5mm Crystal [Digikey: -10-70°C: 644-1049-1-ND -40-125°C: 644-1129-2-ND] 16.0 MHz 10pF 10ppm 3.2 x 2.5mm Crystal [Digikey: 644-1100-1-ND] 27.12 MHz 18pF 30ppm 3.2 x 2.5mm Crystal [Digikey: 887-1424-1-ND] 27.12MHz 10pF 10ppm 3.2 x 2.5mm Crystal [Digikey: 887-1329-1-ND] 4.9 x 1.8mm - MEMs SMT Crystal 32.768 KHz 12.5pF 20ppm 4.9 x 1.8mm Crystal [Digikey: SE2415CT-ND] 8.0 x 3.8mm - Surface Mount Crystal 32.768kHz 12.5pF 20ppm -40°C-85°C [Digikey: 535-9166-2-ND] Cylinder 32.768KHz Cylinder Crystal (2x6mm body) [Ex. Digikey: 300-8341-2-ND]
MCP1825 = SteelCaveRobotics-Power:MCP1825: MCP1825 3.3v LDO Linear Regulator
PCB2 = e14_Rpi3_RevA+mirror-pcb copy:RPI3: Device for Raspberry Pi 3 board created by Dave Young for www.element14.com More information and support community is available at https://www.element14.com/community/community/raspberry-pi Device for Raspberry Pi 3 board updated by Gerald Schwarz for www.element14.com On RPI3 addet the layer milling and created a mirrored shield.
Q1 = Transistor:MMBT3906: TRANS PNP 40V 0.2A SOT-23; CREATED_BY: PCB Layout; DIGIKEY_PART_NUMBER: MMBT3906FSCT-ND; MANUFACTURER: ON Semiconductor; MPN: MMBT3906; PACKAGE: SOT-23
Q2 Q3 = Transistor:MMBT3904: TRANS NPN 40V 0.2A SOT-23; CREATED_BY: PCB Layout; DIGIKEY_PART_NUMBER: MMBT3904FSCT-ND; MANUFACTURER: ON Semiconductor; MPN: MMBT3904; PACKAGE: SOT-23-3
Q4 = microbuilder:MOSFET-P: P-Channel Mosfet LEGEND VDS: Voltage Drain-Source ID: Drain Current RDS(ON): Drain-Source On-State Resistance VGS(TH): Gate-Source Threshold Voltage CISS: Drain-Source Input Capacitance SOT-23 Name VDS ID RDS(ON) VGS(TH) CISS Order Number IRLML5103 30V 760mA 600 mOhm -- 75pF @ 25V Digikey: IRLML5103PBFCT-ND IRLML6401 12V 4.3A 50 mOhm 950mV @ 250µA 830pF @ 10V Digikey: IRLML6401PBFTR-ND NTR0202PL 20V 400mA 800 mOhm 2.3V @ 250uA 70pF @ 5V Digikey: NTR0202PLT1GOSTR-ND NTR4101PT1G 20V 1.8A 85 mOhm 1.2V @ 250uA 675pF @ 10V Digikey: NTR4101PT1GOSCT-ND DMP2004K 20V 600mA 900 mOhm 1V @ 250uA 175pF @ 16V Digikey: DMP2004KDICT-ND PMV65XP 20V 3.9A 76 mOhm 950mV @ 1mA 725pF @ 20V Digikey: 568-2358-2-ND TO-252 Name VDS ID RDS(ON) VGS(TH) CISS Order Number AOD417 30V 25A 34 mOhm 3V @ 250µA 920pF @ 15V Digikey: 785-1106-2-ND
R1 R2 R22 R23 RB1-RB9 RF1-RF9 RFV1-RFV3 RVPU1-RVPU3 RVPU11 RVPU22 RVPU33 = resistor:R-EU_: RESISTOR, European symbol
R3-R6 R9-R11 R14-R19 RB10-RB18 = rcl:R-EU_: RESISTOR, European symbol; SPICEPREFIX: R
RFM69HCW = rfm12b _ rfm69cw:RFM12_SMD: RFM12 is a low costing ISM band transceiver module implemented with unique PLL. It works signal ranges from 315/433/868/915MHZ bands, comply with FCC, ETSI regulation. The SPI interface is used to communicate with microcontroller for parameter setting.
RJ45_1 RJ45_2 = 95501-6889 rj45 smt:95501-6889: Molex Cat3 8-Way Female RJ45 Connector Right Angle Surface Mount Unshielded Source: Datasheet <https://www.molex.com/pdm_docs/sd/955016889_sd.pdf>; ALLIED_NUMBER: 70372913; ALLIED_PRICE-STOCK: https://www.alliedelec.com/molex-incorporated-95501-6889/70372913/; DESCRIPTION: Molex Cat3 8-Way Female RJ45 Connector Right Angle Surface Mount Unshielded; HEIGHT: 11.5mm; MANUFACTURER_NAME: Molex; MANUFACTURER_PART_NUMBER: 95501-6889; MOUSER_PART_NUMBER: 538-95501-6889; MOUSER_PRICE-STOCK: https://www.mouser.com/Search/Refine.aspx?Keyword=538-95501-6889; RS_PART_NUMBER: 3862738; RS_PRICE-STOCK: http://uk.rs-online.com/web/p/products/3862738
S1 S2 = KSS221GLFS:KSS221GLFS: IP40 Side Tactile Switch, SPST-NO 50 mA Source: Datasheet <http://uk.rs-online.com/web/p/products/7931689P>; DESCRIPTION: IP40 Side Tactile Switch, SPST-NO 50 mA; HEIGHT: mm; MANUFACTURER_NAME: C & K COMPONENTS; MANUFACTURER_PART_NUMBER: KSS221GLFS; RS_PART_NUMBER: 7931689P; RS_PRICE-STOCK: http://uk.rs-online.com/web/p/products/7931689P
S11 S22 S33 = smd-special:SWS001: SMD Dip Switch 1 pol.
SJ1-SJ21 = SparkFun:SOLDERJUMPER: Solder Jumper Standard SMD solder jumper. Used to automate production. Two varients : Normally Open and Normally Closed are the same, but have different paste layers. NC will have a large amount of paste and should jumper during reflow.
SJ22 = jumper-con_db:SJ-CON: SMD solder JUMPER
STM32F303VB = stm32f303:STM32F303XB
TP4-TP6 = testpad:TP: Test pad
U1 = ESP32-WROOM-32D:ESP32-WROOM-32D: IC: SoC; GPIO, I2C, I2S, IR, SD, SDIO, SPI, UART; 2.7÷3.6VDC; 20dBm; AVAILABILITY: Unavailable; DESCRIPTION: IC: SoC; GPIO, I2C, I2S, IR, SD, SDIO, SPI, UART; 2.7÷3.6VDC; 20dBm; MF: Espressif Systems; MP: ESP32-WROOM-32D; PACKAGE: Module Espressif Systems; PRICE: None
U$2 = BOOST MODULE CN6009:BOOST_MODULE
USB-C = CSP-USC16-TR:CSP-USC16-TR: CSP-USC16-TR TOBY.CO.UK; MPN: CSP-USC16-TR
VREF_3V3 = MCP1501T-33E:MCP1501T-33E
VT1-VT3 = adafruit:2.1MMJACK: 2.1mm x 5.5mm THM DC jack with internal switch. Digikey part #PJ-102A, 4UCON part #05537 2.1mm x 5.5mm SMT DC jack with internal switch. Digikey part #PJ-002A-SMT, 4UCON part #03267 By microbuilder.eu & adafruit.com

## Net classes
0 default: width 0.178 mm, drill 0.5 mm, clearance 0.152 mm
1 power: width 0.254 mm, drill 0.5 mm, clearance 0.152 mm
2 gnd: width 0.203 mm, drill 0.5 mm, clearance 0.152 mm